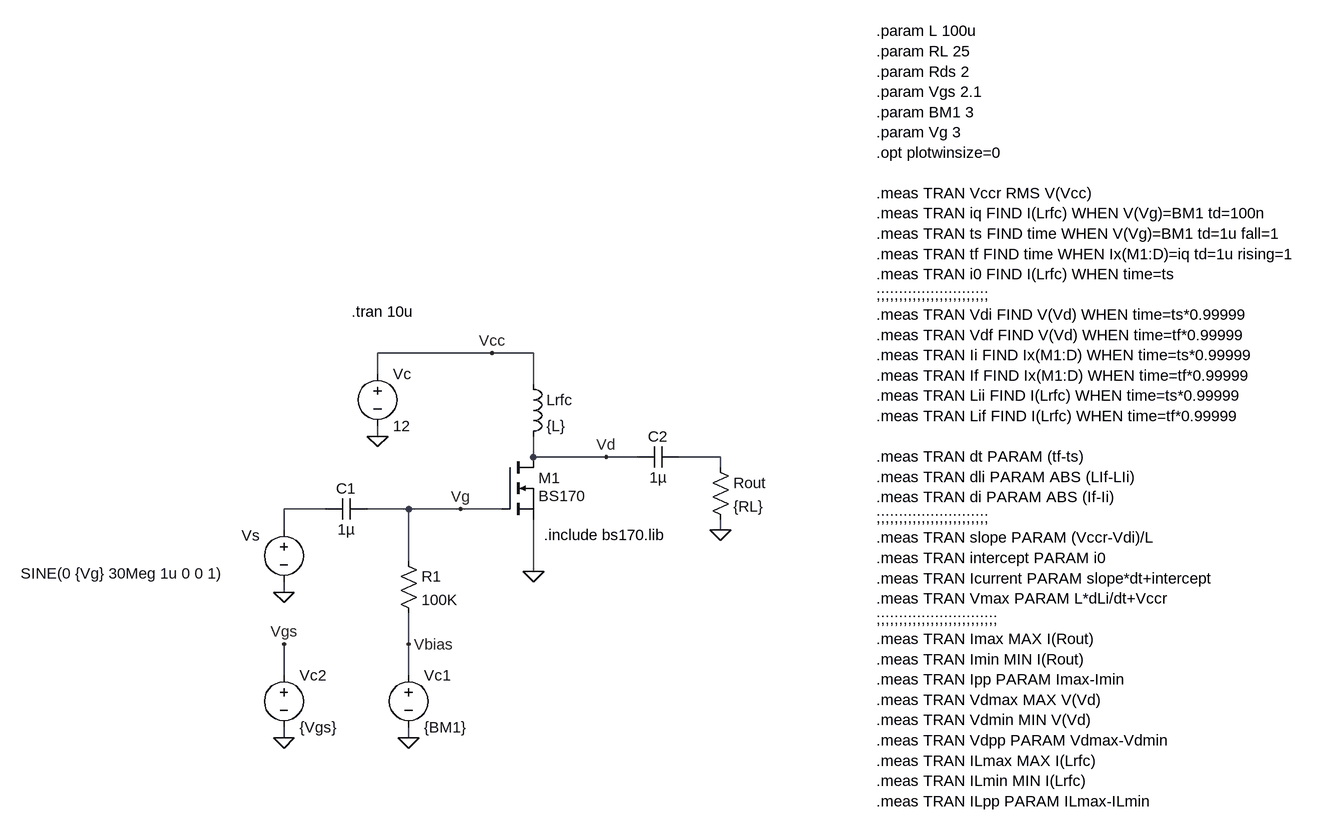
[diagram p0: schematic Inductor Model RF Testing.asc]
Inductor Model RF Testing.asc, the LTspice schematic file:
Version 4
SHEET 1 1528 1728
WIRE 224 0 48 0
WIRE 288 0 224 0
WIRE 48 32 48 0
WIRE 288 48 288 0
WIRE 48 128 48 112
WIRE 288 160 288 128
WIRE 400 160 288 160
WIRE 448 160 400 160
WIRE 576 160 512 160
WIRE 576 176 576 160
WIRE -32 240 -96 240
WIRE 96 240 32 240
WIRE 176 240 96 240
WIRE 240 240 176 240
WIRE -96 272 -96 240
WIRE 576 272 576 256
WIRE 96 320 96 240
WIRE 288 336 288 256
WIRE -96 368 -96 352
WIRE 96 448 96 400
WIRE -96 496 -96 448
WIRE 96 496 96 448
WIRE -96 592 -96 576
WIRE 96 592 96 576
FLAG 48 128 0
FLAG -96 368 0
FLAG 288 336 0
FLAG 576 272 0
FLAG 400 160 Vd
FLAG 176 240 Vg
FLAG 224 0 Vcc
FLAG 96 592 0
FLAG 96 448 Vbias
FLAG -96 592 0
FLAG -96 448 Vgs
SYMBOL voltage 48 16 R0
SYMATTR InstName Vc
SYMATTR Value 12
SYMBOL ind 272 32 R0
SYMATTR InstName Lrfc
SYMATTR Value {L}
SYMBOL voltage -96 256 R0
WINDOW 0 -65 25 Left 2
WINDOW 3 -405 83 Left 2
WINDOW 123 0 0 Left 0
WINDOW 39 0 0 Left 0
SYMATTR InstName Vs
SYMATTR Value SINE(0 {Vg} 30Meg 1u 0 0 1)
SYMBOL res 560 160 R0
SYMATTR InstName Rout
SYMATTR Value {RL}
SYMBOL cap 32 224 R90
WINDOW 0 0 32 VBottom 2
WINDOW 3 32 32 VTop 2
SYMATTR InstName C1
SYMATTR Value 1µ
SYMBOL voltage 96 480 R0
WINDOW 123 0 0 Left 0
WINDOW 39 0 0 Left 0
SYMATTR InstName Vc1
SYMATTR Value {BM1}
SYMBOL res 80 304 R0
SYMATTR InstName R1
SYMATTR Value 100K
SYMBOL voltage -96 480 R0
WINDOW 123 0 0 Left 0
WINDOW 39 0 0 Left 0
SYMATTR InstName Vc2
SYMATTR Value {Vgs}
SYMBOL cap 512 144 R90
WINDOW 0 0 32 VBottom 2
WINDOW 3 32 32 VTop 2
SYMATTR InstName C2
SYMATTR Value 1µ
SYMBOL nmos 240 160 R0
WINDOW 3 56 60 Left 2
SYMATTR Value BS170
SYMATTR InstName M1
SYMATTR Prefix X
TEXT 8 -64 Left 2 !.tran 10u
TEXT 816 -496 Left 2 !.param L 100u\n.param RL 25\n.param Rds 2\n.param Vgs 2.1\n.param BM1 3\n.param Vg 3\n.opt plotwinsize=0\n \n.meas TRAN Vccr RMS V(Vcc)\n.meas TRAN iq FIND I(Lrfc) WHEN V(Vg)=BM1 td=100n\n.meas TRAN ts FIND time WHEN V(Vg)=BM1 td=1u fall=1\n.meas TRAN tf FIND time WHEN Ix(M1:D)=iq td=1u rising=1\n.meas TRAN i0 FIND I(Lrfc) WHEN time=ts\n;;;;;;;;;;;;;;;;;;;;;;;;;\n.meas TRAN Vdi FIND V(Vd) WHEN time=ts*0.99999\n.meas TRAN Vdf FIND V(Vd) WHEN time=tf*0.99999\n.meas TRAN Ii FIND Ix(M1:D) WHEN time=ts*0.99999\n.meas TRAN If FIND Ix(M1:D) WHEN time=tf*0.99999\n.meas TRAN Lii FIND I(Lrfc) WHEN time=ts*0.99999\n.meas TRAN Lif FIND I(Lrfc) WHEN time=tf*0.99999\n \n.meas TRAN dt PARAM (tf-ts)\n.meas TRAN dli PARAM ABS (LIf-LIi)\n.meas TRAN di PARAM ABS (If-Ii)\n;;;;;;;;;;;;;;;;;;;;;;;;;\n.meas TRAN slope PARAM (Vccr-Vdi)/L\n.meas TRAN intercept PARAM i0\n.meas TRAN Icurrent PARAM slope*dt+intercept \n.meas TRAN Vmax PARAM L*dLi/dt+Vccr\n;;;;;;;;;;;;;;;;;;;;;;;;;;; \n.meas TRAN Imax MAX I(Rout)\n.meas TRAN Imin MIN I(Rout)\n.meas TRAN Ipp PARAM Imax-Imin\n.meas TRAN Vdmax MAX V(Vd)\n.meas TRAN Vdmin MIN V(Vd)\n.meas TRAN Vdpp PARAM Vdmax-Vdmin\n.meas TRAN ILmax MAX I(Lrfc)\n.meas TRAN ILmin MIN I(Lrfc)\n.meas TRAN ILpp PARAM ILmax-ILmin
TEXT 304 280 Left 2 !.include bs170.lib

The netlist it stands for:
* Inductor Model RF Testing.asc
Vc Vcc 0 12
Lrfc Vcc Vd {L}
Vs N002 0 SINE(0 {Vg} 30Meg 1u 0 0 1)
Rout N001 0 {RL}
C1 Vg N002 1µ
Vc1 Vbias 0 {BM1}
R1 Vg Vbias 100K
Vc2 Vgs 0 {Vgs}
C2 N001 Vd 1µ
XM1 Vd Vg 0 BS170  ; pins D G S
.tran 10u
.param L 100u
.param RL 25
.param Rds 2
.param Vgs 2.1
.param BM1 3
.param Vg 3
.opt plotwinsize=0
.meas TRAN Vccr RMS V(Vcc)
.meas TRAN iq FIND I(Lrfc) WHEN V(Vg)=BM1 td=100n
.meas TRAN ts FIND time WHEN V(Vg)=BM1 td=1u fall=1
.meas TRAN tf FIND time WHEN Ix(M1:D)=iq td=1u rising=1
.meas TRAN i0 FIND I(Lrfc) WHEN time=ts
;;;;;;;;;;;;;;;;;;;;;;;;;
.meas TRAN Vdi FIND V(Vd) WHEN time=ts*0.99999
.meas TRAN Vdf FIND V(Vd) WHEN time=tf*0.99999
.meas TRAN Ii FIND Ix(M1:D) WHEN time=ts*0.99999
.meas TRAN If FIND Ix(M1:D) WHEN time=tf*0.99999
.meas TRAN Lii FIND I(Lrfc) WHEN time=ts*0.99999
.meas TRAN Lif FIND I(Lrfc) WHEN time=tf*0.99999
.meas TRAN dt PARAM (tf-ts)
.meas TRAN dli PARAM ABS (LIf-LIi)
.meas TRAN di PARAM ABS (If-Ii)
;;;;;;;;;;;;;;;;;;;;;;;;;
.meas TRAN slope PARAM (Vccr-Vdi)/L
.meas TRAN intercept PARAM i0
.meas TRAN Icurrent PARAM slope*dt+intercept
.meas TRAN Vmax PARAM L*dLi/dt+Vccr
;;;;;;;;;;;;;;;;;;;;;;;;;;;
.meas TRAN Imax MAX I(Rout)
.meas TRAN Imin MIN I(Rout)
.meas TRAN Ipp PARAM Imax-Imin
.meas TRAN Vdmax MAX V(Vd)
.meas TRAN Vdmin MIN V(Vd)
.meas TRAN Vdpp PARAM Vdmax-Vdmin
.meas TRAN ILmax MAX I(Lrfc)
.meas TRAN ILmin MIN I(Lrfc)
.meas TRAN ILpp PARAM ILmax-ILmin
.include bs170.lib
.backanno
.end